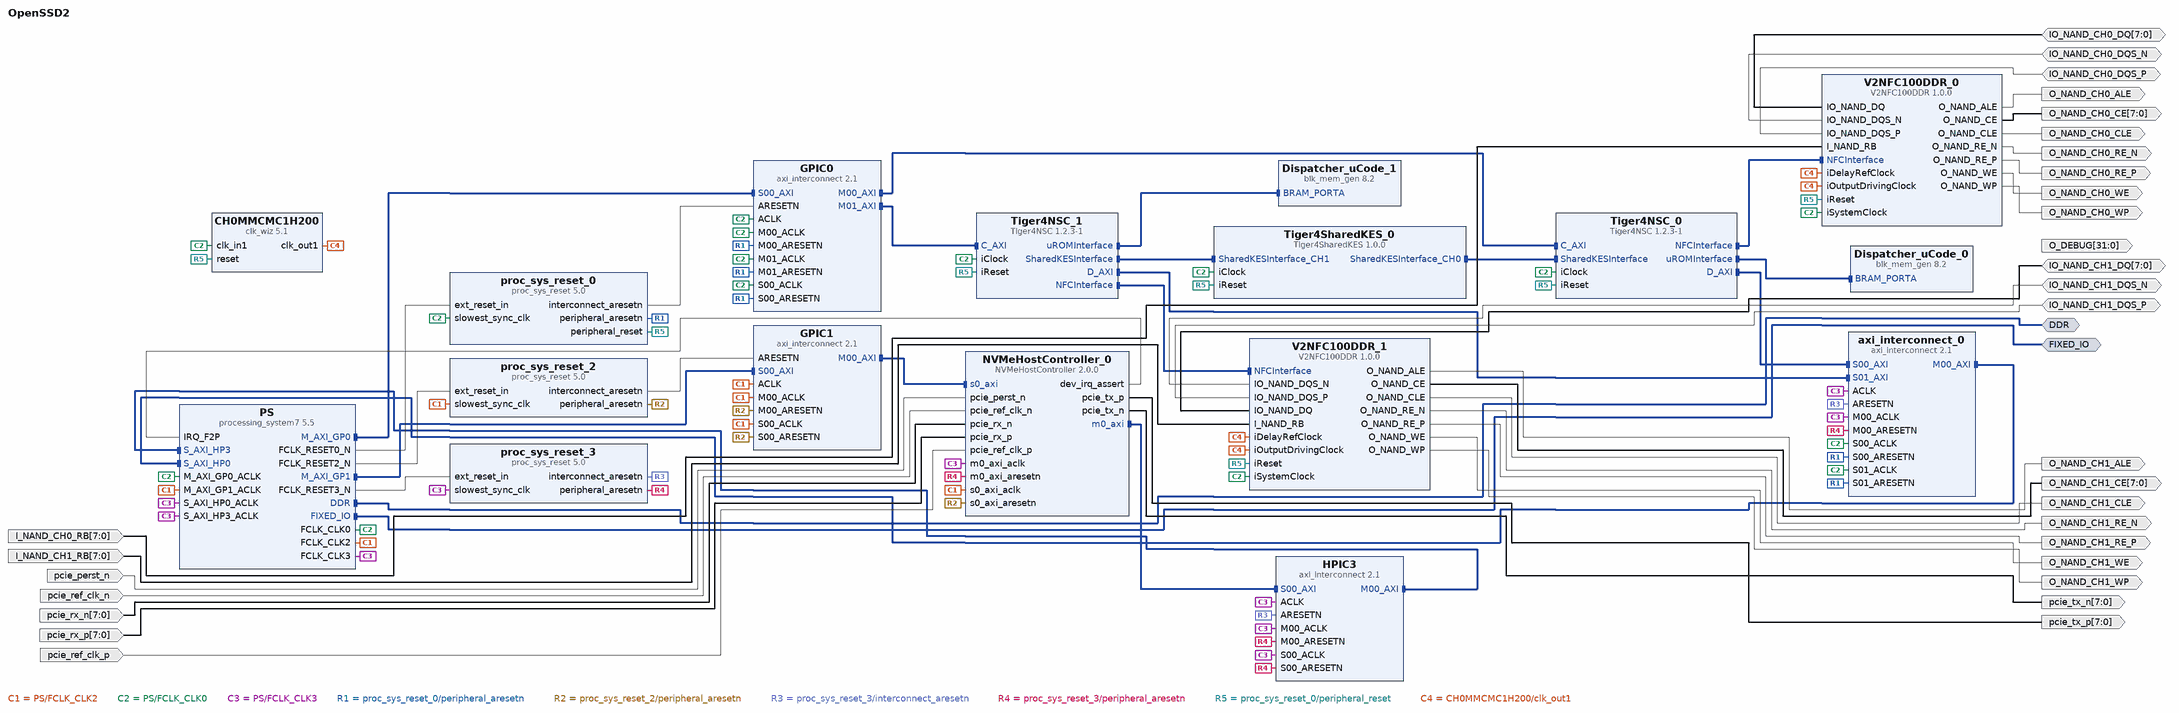
[diagram p0: block diagram of the top level]
# Vivado block design OpenSSD2, Vivado 2014.4.1
create_bd_design OpenSSD2

create_bd_intf_port -mode Master -vlnv xilinx.com:interface:ddrx_rtl:1.0 DDR
create_bd_intf_port -mode Master -vlnv xilinx.com:display_processing_system7:fixedio_rtl:1.0 FIXED_IO
create_bd_port -dir O -from 31 -to 0 O_DEBUG
create_bd_port -dir O O_NAND_CH0_CLE
create_bd_port -dir O O_NAND_CH0_RE_P
create_bd_port -dir O O_NAND_CH0_RE_N
create_bd_port -dir IO IO_NAND_CH0_DQS_N
create_bd_port -dir O O_NAND_CH0_WE
create_bd_port -dir IO -from 7 -to 0 IO_NAND_CH0_DQ
create_bd_port -dir IO IO_NAND_CH0_DQS_P
create_bd_port -dir O -from 7 -to 0 O_NAND_CH0_CE
create_bd_port -dir I -from 7 -to 0 I_NAND_CH0_RB
create_bd_port -dir O O_NAND_CH0_ALE
create_bd_port -dir O O_NAND_CH0_WP
create_bd_port -dir IO IO_NAND_CH1_DQS_N
create_bd_port -dir IO IO_NAND_CH1_DQS_P
create_bd_port -dir I -from 7 -to 0 I_NAND_CH1_RB
create_bd_port -dir IO -from 7 -to 0 IO_NAND_CH1_DQ
create_bd_port -dir O O_NAND_CH1_ALE
create_bd_port -dir O -from 7 -to 0 O_NAND_CH1_CE
create_bd_port -dir O O_NAND_CH1_CLE
create_bd_port -dir O O_NAND_CH1_RE_N
create_bd_port -dir O O_NAND_CH1_RE_P
create_bd_port -dir O O_NAND_CH1_WE
create_bd_port -dir O O_NAND_CH1_WP
create_bd_port -dir I pcie_perst_n
create_bd_port -dir I pcie_ref_clk_n
create_bd_port -dir I -from 7 -to 0 pcie_rx_n
create_bd_port -dir I -from 7 -to 0 pcie_rx_p
create_bd_port -dir I pcie_ref_clk_p
create_bd_port -dir O -from 7 -to 0 pcie_tx_p
create_bd_port -dir O -from 7 -to 0 pcie_tx_n

create_bd_cell -type ip -vlnv xilinx.com:ip:processing_system7:5.5 PS
set_property -dict [list \
  CONFIG.PCW_APU_PERIPHERAL_FREQMHZ 1000 \
  CONFIG.PCW_SDIO_PERIPHERAL_FREQMHZ 50 \
  CONFIG.PCW_FPGA0_PERIPHERAL_FREQMHZ 100 \
  CONFIG.PCW_FPGA1_PERIPHERAL_FREQMHZ 100 \
  CONFIG.PCW_FPGA2_PERIPHERAL_FREQMHZ 200 \
  CONFIG.PCW_FPGA3_PERIPHERAL_FREQMHZ 250 \
  CONFIG.PCW_USE_M_AXI_GP1 1 \
  CONFIG.PCW_USE_S_AXI_HP0 1 \
  CONFIG.PCW_USE_S_AXI_HP3 1 \
  CONFIG.PCW_USE_FABRIC_INTERRUPT 1 \
  CONFIG.PCW_EN_CLK2_PORT 1 \
  CONFIG.PCW_EN_CLK3_PORT 1 \
  CONFIG.PCW_EN_RST2_PORT 1 \
  CONFIG.PCW_EN_RST3_PORT 1 \
  CONFIG.PCW_IRQ_F2P_INTR 1 \
  CONFIG.PCW_PRESET_BANK0_VOLTAGE {LVCMOS 1.8V} \
  CONFIG.PCW_PRESET_BANK1_VOLTAGE {LVCMOS 1.8V} \
  CONFIG.PCW_UIPARAM_DDR_PARTNO Custom \
  CONFIG.PCW_QSPI_PERIPHERAL_ENABLE 1 \
  CONFIG.PCW_QSPI_GRP_SINGLE_SS_ENABLE 0 \
  CONFIG.PCW_QSPI_GRP_IO1_ENABLE 1 \
  CONFIG.PCW_QSPI_GRP_FBCLK_ENABLE 1 \
  CONFIG.PCW_ENET0_PERIPHERAL_ENABLE 1 \
  CONFIG.PCW_ENET0_ENET0_IO {MIO 16 .. 27} \
  CONFIG.PCW_ENET0_GRP_MDIO_ENABLE 1 \
  CONFIG.PCW_ENET0_RESET_ENABLE 1 \
  CONFIG.PCW_ENET0_RESET_IO {MIO 47} \
  CONFIG.PCW_SD0_PERIPHERAL_ENABLE 1 \
  CONFIG.PCW_SD0_GRP_CD_ENABLE 1 \
  CONFIG.PCW_SD0_GRP_CD_IO {MIO 14} \
  CONFIG.PCW_SD0_GRP_WP_ENABLE 1 \
  CONFIG.PCW_SD0_GRP_WP_IO {MIO 15} \
  CONFIG.PCW_UART1_PERIPHERAL_ENABLE 1 \
  CONFIG.PCW_USB0_PERIPHERAL_ENABLE 1 \
  CONFIG.PCW_USB0_RESET_ENABLE 1 \
  CONFIG.PCW_USB0_RESET_IO {MIO 7} \
  CONFIG.PCW_I2C0_PERIPHERAL_ENABLE 1 \
  CONFIG.PCW_I2C0_I2C0_IO {MIO 50 .. 51} \
  CONFIG.PCW_I2C0_RESET_ENABLE 1 \
  CONFIG.PCW_I2C0_RESET_IO {MIO 46} \
  CONFIG.PCW_GPIO_MIO_GPIO_ENABLE 1 \
  CONFIG.PCW_ENET0_PERIPHERAL_FREQMHZ {100 Mbps} \
] [get_bd_cells PS]
# 80 more settings of PS are not shown: defaults, MIO pin electricals, DDR timing, and values the tool derives
create_bd_cell -type ip -vlnv ENCLab:ip:V2NFC100DDR:1.0.0 V2NFC100DDR_0
create_bd_cell -type ip -vlnv xilinx.com:ip:axi_interconnect:2.1 GPIC0
set_property -dict {CONFIG.NUM_MI 2 CONFIG.ENABLE_ADVANCED_OPTIONS 1 CONFIG.S00_HAS_DATA_FIFO 0} [get_bd_cells GPIC0]
create_bd_cell -type ip -vlnv xilinx.com:ip:proc_sys_reset:5.0 proc_sys_reset_0
create_bd_cell -type ip -vlnv xilinx.com:ip:proc_sys_reset:5.0 proc_sys_reset_2
create_bd_cell -type ip -vlnv xilinx.com:ip:proc_sys_reset:5.0 proc_sys_reset_3
create_bd_cell -type ip -vlnv ENCLab:ip:V2NFC100DDR:1.0.0 V2NFC100DDR_1
create_bd_cell -type ip -vlnv xilinx.com:ip:clk_wiz:5.1 CH0MMCMC1H200
set_property -dict [list \
  CONFIG.JITTER_SEL Min_O_Jitter \
  CONFIG.CLKOUT1_REQUESTED_OUT_FREQ 200 \
  CONFIG.PRIM_SOURCE Global_buffer \
  CONFIG.USE_LOCKED false \
  CONFIG.CLKOUT1_JITTER 81.410 \
  CONFIG.CLKOUT1_PHASE_ERROR 74.126 \
] [get_bd_cells CH0MMCMC1H200]
create_bd_cell -type ip -vlnv xilinx.com:ip:axi_interconnect:2.1 HPIC3
set_property -dict {CONFIG.NUM_MI 1} [get_bd_cells HPIC3]
create_bd_cell -type ip -vlnv xilinx.com:ip:axi_interconnect:2.1 GPIC1
set_property -dict {CONFIG.NUM_MI 1} [get_bd_cells GPIC1]
create_bd_cell -type ip -vlnv xilinx.com:ip:blk_mem_gen:8.2 Dispatcher_uCode_0
set_property -dict [list \
  CONFIG.Enable_32bit_Address false \
  CONFIG.Use_Byte_Write_Enable false \
  CONFIG.Write_Width_A 64 \
  CONFIG.Write_Depth_A 256 \
  CONFIG.Read_Width_A 64 \
  CONFIG.Register_PortA_Output_of_Memory_Primitives true \
  CONFIG.Load_Init_File true \
  CONFIG.Coe_File ../../../../uProgROM_v2.0.coe \
  CONFIG.Use_RSTA_Pin true \
  CONFIG.use_bram_block Stand_Alone \
] [get_bd_cells Dispatcher_uCode_0]
create_bd_cell -type ip -vlnv xilinx.com:ip:blk_mem_gen:8.2 Dispatcher_uCode_1
set_property -dict [list \
  CONFIG.Enable_32bit_Address false \
  CONFIG.Use_Byte_Write_Enable false \
  CONFIG.Write_Width_A 64 \
  CONFIG.Write_Depth_A 256 \
  CONFIG.Read_Width_A 64 \
  CONFIG.Register_PortA_Output_of_Memory_Primitives true \
  CONFIG.Load_Init_File true \
  CONFIG.Coe_File ../../../../uProgROM_v2.0.coe \
  CONFIG.Use_RSTA_Pin true \
  CONFIG.use_bram_block Stand_Alone \
] [get_bd_cells Dispatcher_uCode_1]
create_bd_cell -type ip -vlnv ENCLab:ip:NVMeHostController:2.0.0 NVMeHostController_0
create_bd_cell -type ip -vlnv xilinx.com:ip:axi_interconnect:2.1 axi_interconnect_0
set_property -dict [list \
  CONFIG.NUM_SI 2 \
  CONFIG.NUM_MI 1 \
  CONFIG.STRATEGY 2 \
  CONFIG.ENABLE_ADVANCED_OPTIONS 1 \
  CONFIG.M00_HAS_REGSLICE 1 \
  CONFIG.M01_HAS_REGSLICE 1 \
  CONFIG.M00_HAS_DATA_FIFO 2 \
  CONFIG.S00_HAS_REGSLICE 1 \
  CONFIG.S01_HAS_REGSLICE 1 \
  CONFIG.S02_HAS_REGSLICE 1 \
  CONFIG.S03_HAS_REGSLICE 1 \
] [get_bd_cells axi_interconnect_0]
create_bd_cell -type ip -vlnv ENCLab:ip:Tiger4NSC:1.2.3-1 Tiger4NSC_0
create_bd_cell -type ip -vlnv ENCLab:ip:Tiger4NSC:1.2.3-1 Tiger4NSC_1
create_bd_cell -type ip -vlnv ENCLab:ip:Tiger4SharedKES:1.0.0 Tiger4SharedKES_0

# ---- connections ----

connect_bd_intf_net [get_bd_intf_pins PS/M_AXI_GP0] [get_bd_intf_pins GPIC0/S00_AXI]
connect_bd_intf_net [get_bd_intf_pins HPIC3/M00_AXI] [get_bd_intf_pins PS/S_AXI_HP3]
connect_bd_intf_net [get_bd_intf_pins GPIC1/S00_AXI] [get_bd_intf_pins PS/M_AXI_GP1]
connect_bd_intf_net [get_bd_intf_pins GPIC1/M00_AXI] [get_bd_intf_pins NVMeHostController_0/s0_axi]
connect_bd_intf_net [get_bd_intf_pins NVMeHostController_0/m0_axi] [get_bd_intf_pins HPIC3/S00_AXI]
connect_bd_intf_net [get_bd_intf_pins GPIC0/M00_AXI] [get_bd_intf_pins Tiger4NSC_0/C_AXI]
connect_bd_intf_net [get_bd_intf_pins Tiger4NSC_0/uROMInterface] [get_bd_intf_pins Dispatcher_uCode_0/BRAM_PORTA]
connect_bd_intf_net [get_bd_intf_pins Tiger4NSC_1/C_AXI] [get_bd_intf_pins GPIC0/M01_AXI]
connect_bd_intf_net [get_bd_intf_pins Tiger4NSC_1/uROMInterface] [get_bd_intf_pins Dispatcher_uCode_1/BRAM_PORTA]
connect_bd_intf_net [get_bd_intf_pins Tiger4SharedKES_0/SharedKESInterface_CH0] [get_bd_intf_pins Tiger4NSC_0/SharedKESInterface]
connect_bd_intf_net [get_bd_intf_pins Tiger4NSC_1/SharedKESInterface] [get_bd_intf_pins Tiger4SharedKES_0/SharedKESInterface_CH1]
connect_bd_intf_net [get_bd_intf_pins Tiger4NSC_0/D_AXI] [get_bd_intf_pins axi_interconnect_0/S00_AXI]
connect_bd_intf_net [get_bd_intf_pins axi_interconnect_0/S01_AXI] [get_bd_intf_pins Tiger4NSC_1/D_AXI]
connect_bd_intf_net [get_bd_intf_pins axi_interconnect_0/M00_AXI] [get_bd_intf_pins PS/S_AXI_HP0]
connect_bd_intf_net [get_bd_intf_pins Tiger4NSC_0/NFCInterface] [get_bd_intf_pins V2NFC100DDR_0/NFCInterface]
connect_bd_intf_net [get_bd_intf_pins Tiger4NSC_1/NFCInterface] [get_bd_intf_pins V2NFC100DDR_1/NFCInterface]
connect_bd_intf_net -intf_net processing_system7_0_DDR [get_bd_intf_ports DDR] [get_bd_intf_pins PS/DDR]
connect_bd_intf_net -intf_net processing_system7_0_FIXED_IO [get_bd_intf_ports FIXED_IO] [get_bd_intf_pins PS/FIXED_IO]
connect_bd_net [get_bd_pins PS/FCLK_CLK2] \
  [get_bd_pins proc_sys_reset_2/slowest_sync_clk] [get_bd_pins PS/M_AXI_GP1_ACLK] \
  [get_bd_pins NVMeHostController_0/s0_axi_aclk] [get_bd_pins GPIC1/ACLK] [get_bd_pins GPIC1/S00_ACLK] \
  [get_bd_pins GPIC1/M00_ACLK]
connect_bd_net [get_bd_pins PS/FCLK_CLK0] \
  [get_bd_pins proc_sys_reset_0/slowest_sync_clk] [get_bd_pins V2NFC100DDR_0/iSystemClock] \
  [get_bd_pins V2NFC100DDR_1/iSystemClock] [get_bd_pins CH0MMCMC1H200/clk_in1] [get_bd_pins PS/M_AXI_GP0_ACLK] \
  [get_bd_pins GPIC0/M00_ACLK] [get_bd_pins GPIC0/M01_ACLK] [get_bd_pins GPIC0/ACLK] [get_bd_pins GPIC0/S00_ACLK] \
  [get_bd_pins axi_interconnect_0/S00_ACLK] [get_bd_pins axi_interconnect_0/S01_ACLK] [get_bd_pins Tiger4NSC_0/iClock] \
  [get_bd_pins Tiger4NSC_1/iClock] [get_bd_pins Tiger4SharedKES_0/iClock]
connect_bd_net [get_bd_pins PS/FCLK_RESET0_N] [get_bd_pins proc_sys_reset_0/ext_reset_in]
connect_bd_net [get_bd_pins PS/FCLK_RESET2_N] [get_bd_pins proc_sys_reset_2/ext_reset_in]
connect_bd_net [get_bd_pins PS/FCLK_RESET3_N] [get_bd_pins proc_sys_reset_3/ext_reset_in]
connect_bd_net [get_bd_pins PS/FCLK_CLK3] \
  [get_bd_pins proc_sys_reset_3/slowest_sync_clk] [get_bd_pins PS/S_AXI_HP0_ACLK] [get_bd_pins PS/S_AXI_HP3_ACLK] \
  [get_bd_pins NVMeHostController_0/m0_axi_aclk] [get_bd_pins HPIC3/ACLK] [get_bd_pins HPIC3/S00_ACLK] \
  [get_bd_pins HPIC3/M00_ACLK] [get_bd_pins axi_interconnect_0/ACLK] [get_bd_pins axi_interconnect_0/M00_ACLK]
connect_bd_net -net M00_ARESETN_1 [get_bd_pins proc_sys_reset_0/peripheral_aresetn] \
  [get_bd_pins GPIC0/M00_ARESETN] [get_bd_pins GPIC0/M01_ARESETN] [get_bd_pins GPIC0/S00_ARESETN] \
  [get_bd_pins axi_interconnect_0/S00_ARESETN] [get_bd_pins axi_interconnect_0/S01_ARESETN]
connect_bd_net [get_bd_pins proc_sys_reset_2/peripheral_aresetn] \
  [get_bd_pins NVMeHostController_0/s0_axi_aresetn] [get_bd_pins GPIC1/S00_ARESETN] [get_bd_pins GPIC1/M00_ARESETN]
connect_bd_net -net ARESETN_2 [get_bd_pins proc_sys_reset_3/interconnect_aresetn] [get_bd_pins HPIC3/ARESETN] [get_bd_pins axi_interconnect_0/ARESETN]
connect_bd_net -net M00_ARESETN_2 [get_bd_pins proc_sys_reset_3/peripheral_aresetn] \
  [get_bd_pins NVMeHostController_0/m0_axi_aresetn] [get_bd_pins HPIC3/M00_ARESETN] [get_bd_pins HPIC3/S00_ARESETN] \
  [get_bd_pins axi_interconnect_0/M00_ARESETN]
connect_bd_net [get_bd_pins proc_sys_reset_0/peripheral_reset] \
  [get_bd_pins V2NFC100DDR_0/iReset] [get_bd_pins V2NFC100DDR_1/iReset] [get_bd_pins CH0MMCMC1H200/reset] \
  [get_bd_pins Tiger4NSC_0/iReset] [get_bd_pins Tiger4NSC_1/iReset] [get_bd_pins Tiger4SharedKES_0/iReset]
connect_bd_net [get_bd_pins CH0MMCMC1H200/clk_out1] \
  [get_bd_pins V2NFC100DDR_0/iDelayRefClock] [get_bd_pins V2NFC100DDR_0/iOutputDrivingClock] \
  [get_bd_pins V2NFC100DDR_1/iDelayRefClock] [get_bd_pins V2NFC100DDR_1/iOutputDrivingClock]
connect_bd_net -net ARESETN_3 [get_bd_pins proc_sys_reset_2/interconnect_aresetn] [get_bd_pins GPIC1/ARESETN]
connect_bd_net [get_bd_pins NVMeHostController_0/dev_irq_assert] [get_bd_pins PS/IRQ_F2P]
connect_bd_net [get_bd_pins V2NFC100DDR_0/O_NAND_CLE] [get_bd_ports O_NAND_CH0_CLE]
connect_bd_net [get_bd_pins V2NFC100DDR_0/O_NAND_RE_P] [get_bd_ports O_NAND_CH0_RE_P]
connect_bd_net [get_bd_pins V2NFC100DDR_0/O_NAND_RE_N] [get_bd_ports O_NAND_CH0_RE_N]
connect_bd_net [get_bd_ports IO_NAND_CH0_DQS_N] [get_bd_pins V2NFC100DDR_0/IO_NAND_DQS_N]
connect_bd_net [get_bd_pins V2NFC100DDR_0/O_NAND_WE] [get_bd_ports O_NAND_CH0_WE]
connect_bd_net [get_bd_ports IO_NAND_CH0_DQ] [get_bd_pins V2NFC100DDR_0/IO_NAND_DQ]
connect_bd_net [get_bd_ports IO_NAND_CH0_DQS_P] [get_bd_pins V2NFC100DDR_0/IO_NAND_DQS_P]
connect_bd_net [get_bd_pins V2NFC100DDR_0/O_NAND_CE] [get_bd_ports O_NAND_CH0_CE]
connect_bd_net -net I_NAND_RB_1 [get_bd_ports I_NAND_CH0_RB] [get_bd_pins V2NFC100DDR_0/I_NAND_RB]
connect_bd_net [get_bd_pins V2NFC100DDR_0/O_NAND_ALE] [get_bd_ports O_NAND_CH0_ALE]
connect_bd_net [get_bd_pins V2NFC100DDR_0/O_NAND_WP] [get_bd_ports O_NAND_CH0_WP]
connect_bd_net [get_bd_ports IO_NAND_CH1_DQS_N] [get_bd_pins V2NFC100DDR_1/IO_NAND_DQS_N]
connect_bd_net [get_bd_ports IO_NAND_CH1_DQS_P] [get_bd_pins V2NFC100DDR_1/IO_NAND_DQS_P]
connect_bd_net -net I_NAND_RB_2 [get_bd_ports I_NAND_CH1_RB] [get_bd_pins V2NFC100DDR_1/I_NAND_RB]
connect_bd_net [get_bd_ports IO_NAND_CH1_DQ] [get_bd_pins V2NFC100DDR_1/IO_NAND_DQ]
connect_bd_net [get_bd_pins V2NFC100DDR_1/O_NAND_ALE] [get_bd_ports O_NAND_CH1_ALE]
connect_bd_net [get_bd_pins V2NFC100DDR_1/O_NAND_CE] [get_bd_ports O_NAND_CH1_CE]
connect_bd_net [get_bd_pins V2NFC100DDR_1/O_NAND_CLE] [get_bd_ports O_NAND_CH1_CLE]
connect_bd_net [get_bd_pins V2NFC100DDR_1/O_NAND_RE_N] [get_bd_ports O_NAND_CH1_RE_N]
connect_bd_net [get_bd_pins V2NFC100DDR_1/O_NAND_RE_P] [get_bd_ports O_NAND_CH1_RE_P]
connect_bd_net [get_bd_pins V2NFC100DDR_1/O_NAND_WE] [get_bd_ports O_NAND_CH1_WE]
connect_bd_net [get_bd_pins V2NFC100DDR_1/O_NAND_WP] [get_bd_ports O_NAND_CH1_WP]
connect_bd_net [get_bd_ports pcie_perst_n] [get_bd_pins NVMeHostController_0/pcie_perst_n]
connect_bd_net [get_bd_ports pcie_ref_clk_n] [get_bd_pins NVMeHostController_0/pcie_ref_clk_n]
connect_bd_net [get_bd_ports pcie_rx_n] [get_bd_pins NVMeHostController_0/pcie_rx_n]
connect_bd_net [get_bd_ports pcie_rx_p] [get_bd_pins NVMeHostController_0/pcie_rx_p]
connect_bd_net [get_bd_ports pcie_ref_clk_p] [get_bd_pins NVMeHostController_0/pcie_ref_clk_p]
connect_bd_net [get_bd_pins NVMeHostController_0/pcie_tx_p] [get_bd_ports pcie_tx_p]
connect_bd_net [get_bd_pins NVMeHostController_0/pcie_tx_n] [get_bd_ports pcie_tx_n]
connect_bd_net -net ARESETN_1 [get_bd_pins proc_sys_reset_0/interconnect_aresetn] [get_bd_pins GPIC0/ARESETN]

# ---- address map ----
assign_bd_address -offset 0x0 -range 1G -target_address_space [get_bd_addr_spaces NVMeHostController_0/m0_axi] [get_bd_addr_segs PS/S_AXI_HP3/HP3_DDR_LOWOCM]
assign_bd_address -offset 0x43C00000 -range 64K -target_address_space [get_bd_addr_spaces PS/Data] [get_bd_addr_segs Tiger4NSC_0/C_AXI/reg0]
assign_bd_address -offset 0x43C10000 -range 64K -target_address_space [get_bd_addr_spaces PS/Data] [get_bd_addr_segs Tiger4NSC_1/C_AXI/reg0]
assign_bd_address -offset 0x83C00000 -range 64K -target_address_space [get_bd_addr_spaces PS/Data] [get_bd_addr_segs NVMeHostController_0/s0_axi/reg0]
assign_bd_address -offset 0x0 -range 1G -target_address_space [get_bd_addr_spaces Tiger4NSC_0/D_AXI] [get_bd_addr_segs PS/S_AXI_HP0/HP0_DDR_LOWOCM]
assign_bd_address -offset 0x0 -range 1G -target_address_space [get_bd_addr_spaces Tiger4NSC_1/D_AXI] [get_bd_addr_segs PS/S_AXI_HP0/HP0_DDR_LOWOCM]

validate_bd_design
save_bd_design
